# EAGLE schematic Dragon_LowerCase_orig (EAGLE 7.7.0)
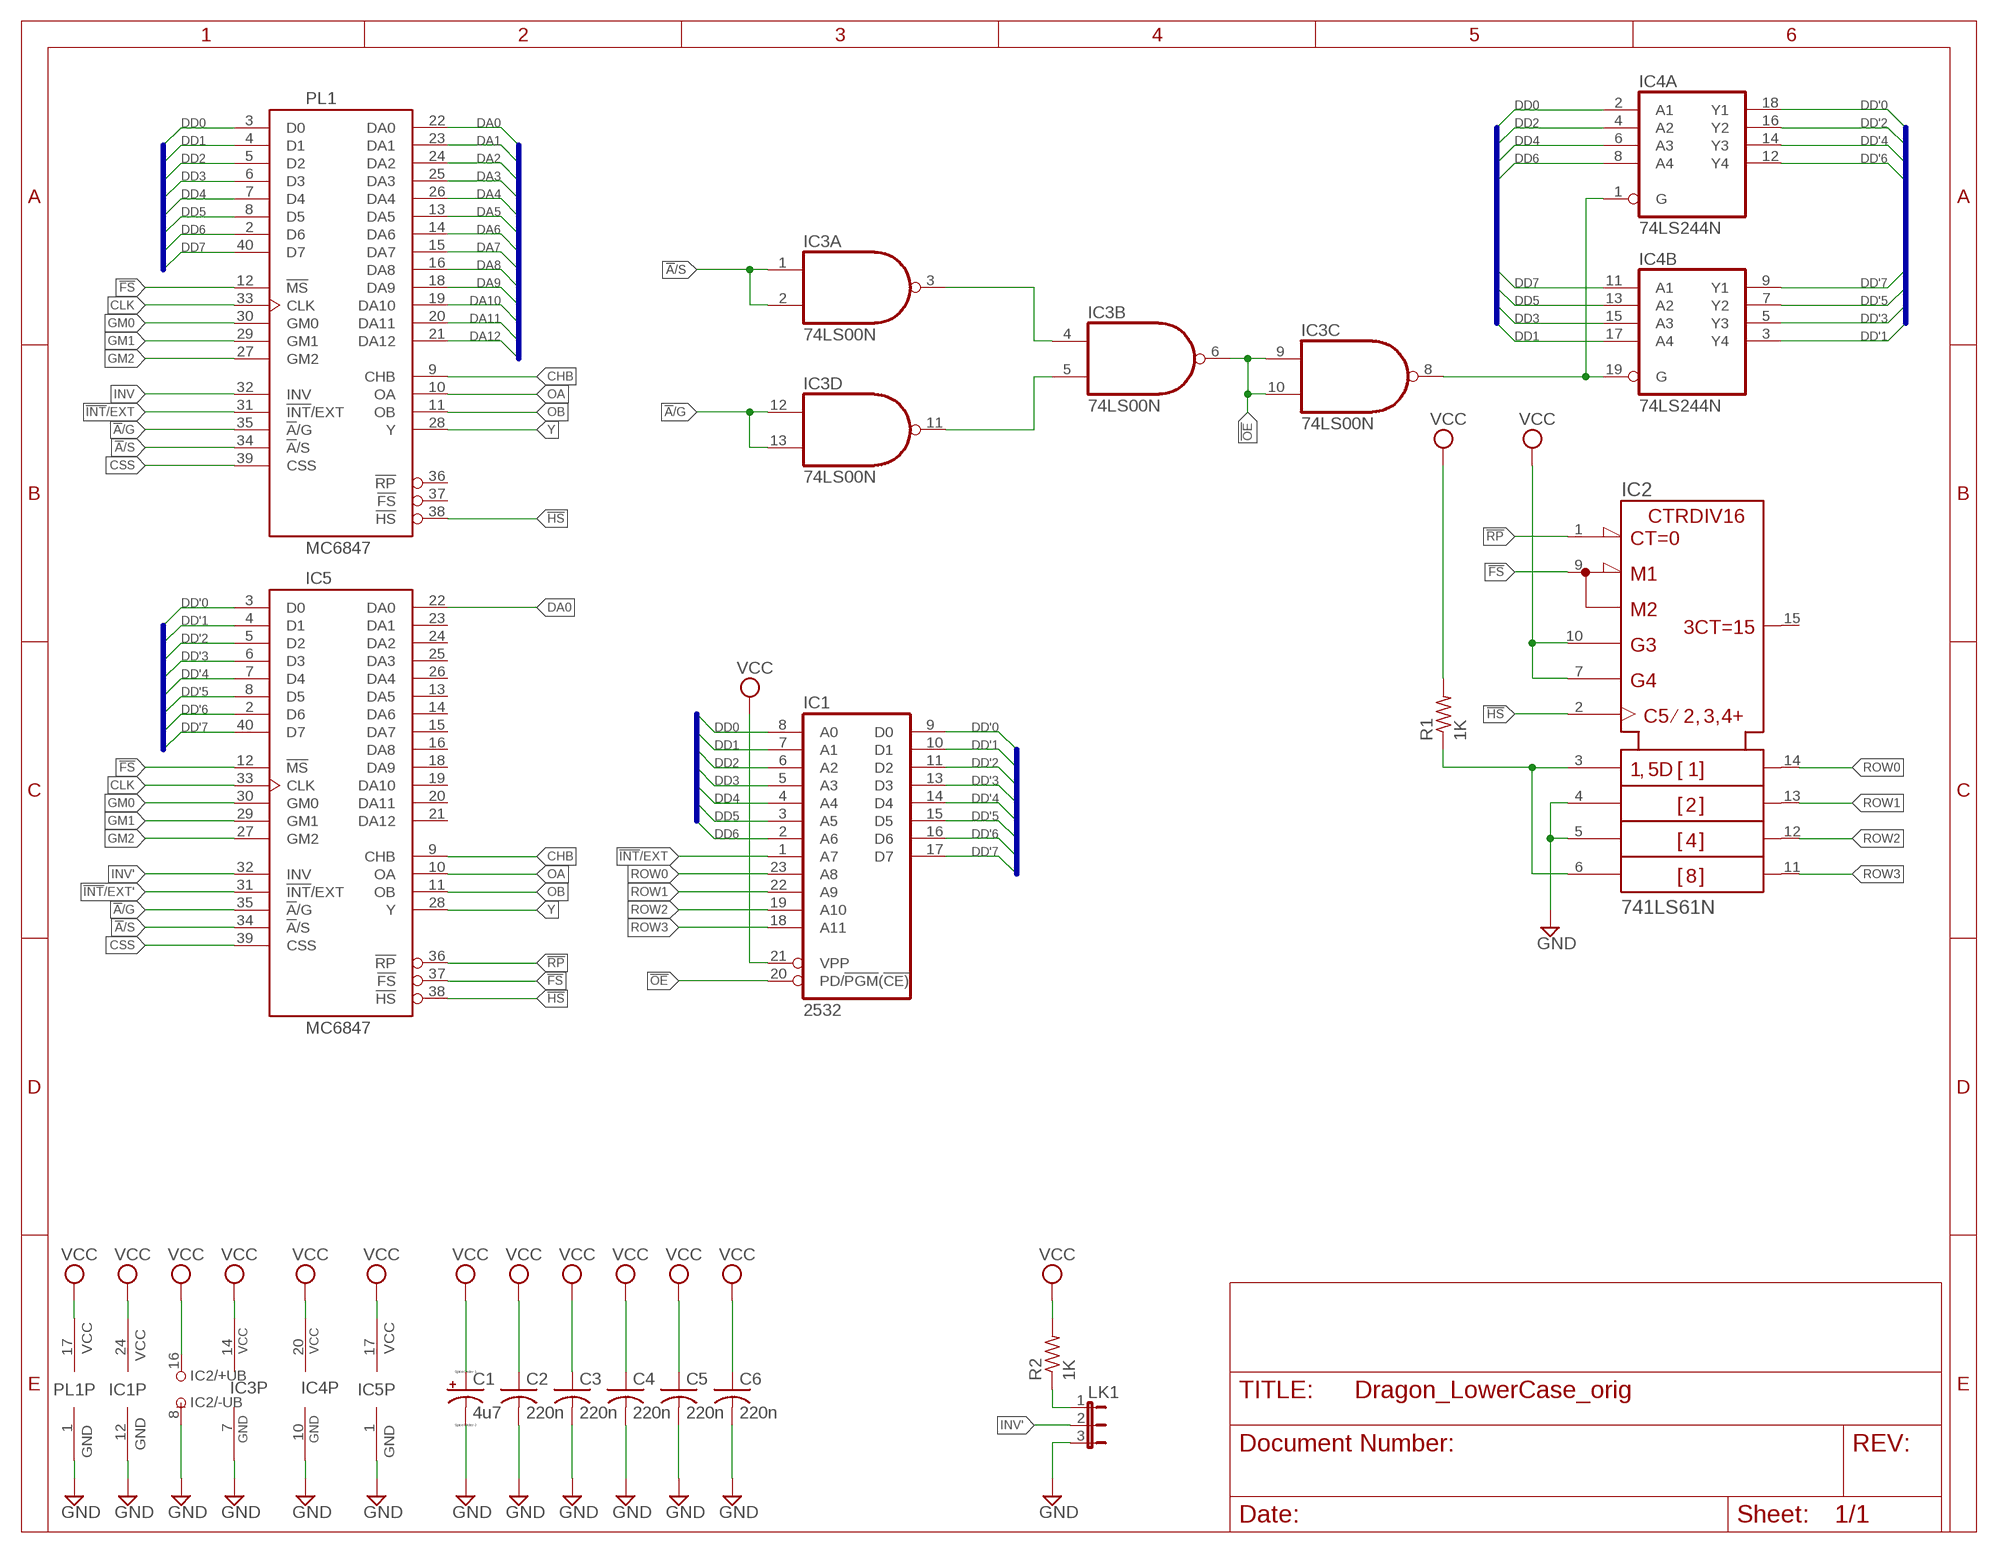
[diagram p0: schematic, sheet 1]

## Parts
C1  4u7  CPOL-USE2.5-5  [E2,5-5]
C2  220n  C-US025-025X050  [C025-025X050]
C3  220n  C-US025-025X050  [C025-025X050]
C4  220n  C-US025-025X050  [C025-025X050]
C5  220n  C-US025-025X050  [C025-025X050]
C6  220n  C-US025-025X050  [C025-025X050]
IC1  2532  [DIL24-6-RP]
IC2  741LS61N  74161N  [DIL16]
IC3  74LS00N  [DIL14-RP]
IC4  74LS244N  [DIL20-RP]
IC5  MC6847  [DIL40]
LK1  JP2E  [JP2]
PL1  MC6847  [DIL40]
R1  1K  R-US_0207/10  [0207/10]
R2  1K  R-US_0207/10  [0207/10]

## Nets
!A!/G: IC3.12(D:I0) IC3.13(D:I1) IC5.35(!A!/G) PL1.35(!A!/G)
!A!/S: IC3.1(A:I0) IC3.2(A:I1) IC5.34(!A!/S) PL1.34(!A!/S)
!FS: IC2.9(!LOAD) IC5.12(!MS) IC5.37(!FS) PL1.12(!MS)
!HS: IC2.2(CLK) IC5.38(!HS) PL1.38(!HS)
!INT!/EXT: IC1.1(A7) PL1.31(!INT!/EXT)
!INT!/EXT': IC3.3(A:O) IC3.4(B:I0) IC5.31(!INT!/EXT)
!OE: IC1.20(PD/!PGM!(!CE)) IC3.6(B:O) IC3.9(C:I0) IC3.10(C:I1)
!RP: IC2.1(!CLR) IC5.36(!RP)
CHB: IC5.9(CHB) PL1.9(CHB)
CLK: IC5.33(CLK) PL1.33(CLK)
CSS: IC5.39(CSS) PL1.39(CSS)
DA0: IC5.22(DA0) PL1.22(DA0)
DA1: PL1.23(DA1)
DA2: PL1.24(DA2)
DA3: PL1.25(DA3)
DA4: PL1.26(DA4)
DA5: PL1.13(DA5)
DA6: PL1.14(DA6)
DA7: PL1.15(DA7)
DA8: PL1.16(DA8)
DA9: PL1.18(DA9)
DA10: PL1.19(DA10)
DA11: PL1.20(DA11)
DA12: PL1.21(DA12)
DD0: IC1.8(A0) IC4.2(A:A1) PL1.3(D0)
DD1: IC1.7(A1) IC4.17(B:A4) PL1.4(D1)
DD2: IC1.6(A2) IC4.4(A:A2) PL1.5(D2)
DD3: IC1.5(A3) IC4.15(B:A3) PL1.6(D3)
DD4: IC1.4(A4) IC4.6(A:A3) PL1.7(D4)
DD5: IC1.3(A5) IC4.13(B:A2) PL1.8(D5)
DD6: IC1.2(A6) IC4.8(A:A4) PL1.2(D6)
DD7: IC4.11(B:A1) PL1.40(D7)
DD'0: IC1.9(D0) IC4.18(A:Y1) IC5.3(D0)
DD'1: IC1.10(D1) IC4.3(B:Y4) IC5.4(D1)
DD'2: IC1.11(D2) IC4.16(A:Y2) IC5.5(D2)
DD'3: IC1.13(D3) IC4.5(B:Y3) IC5.6(D3)
DD'4: IC1.14(D4) IC4.14(A:Y3) IC5.7(D4)
DD'5: IC1.15(D5) IC4.7(B:Y2) IC5.8(D5)
DD'6: IC1.16(D6) IC4.12(A:Y4) IC5.2(D6)
DD'7: IC1.17(D7) IC4.9(B:Y1) IC5.40(D7)
GM0: IC5.30(GM0) PL1.30(GM0)
GM1: IC5.29(GM1) PL1.29(GM1)
GM2: IC5.27(GM2) PL1.27(GM2)
GND: C1.- C2.2 C3.2 C4.2 C5.2 C6.2 IC1.12(GND) IC2.4(B) IC2.5(C) IC2.8(-UB) IC3.7(P:GND) IC4.10(P:GND) IC5.1(GND) LK1.3 PL1.1(GND)
INV: PL1.32(INV)
INV': IC5.32(INV) LK1.2
N$1: IC2.3(A) IC2.6(D) R1.1
N$2: IC3.8(C:O) IC4.1(A:G) IC4.19(B:G)
N$3: LK1.1 R2.1
N$14: IC3.5(B:I1) IC3.11(D:O)
OA: IC5.10(OA) PL1.10(OA)
OB: IC5.11(OB) PL1.11(OB)
ROW0: IC1.23(A8) IC2.14(QA)
ROW1: IC1.22(A9) IC2.13(QB)
ROW2: IC1.19(A10) IC2.12(QC)
ROW3: IC1.18(A11) IC2.11(QD)
VCC: C1.+ C2.1 C3.1 C4.1 C5.1 C6.1 IC1.21(VPP) IC1.24(VCC) IC2.7(ENP) IC2.10(ENT) IC2.16(+UB) IC3.14(P:VCC) IC4.20(P:VCC) IC5.17(VCC) PL1.17(VCC) R1.2 R2.2
Y: IC5.28(Y) PL1.28(Y)
Unconnected: IC2.15(RCO) IC5.13(DA5) IC5.14(DA6) IC5.15(DA7) IC5.16(DA8) IC5.18(DA9) IC5.19(DA10) IC5.20(DA11) IC5.21(DA12) IC5.23(DA1) IC5.24(DA2) IC5.25(DA3) IC5.26(DA4) PL1.36(!RP) PL1.37(!FS)

## Buses
DA[0..12]
DD[0..7]
DD'[0..7]

## Library data of the parts
C1 = resistor:CPOL-US: POLARIZED CAPACITOR, American symbol
C2-C6 = resistor:C-US: CAPACITOR, American symbol
IC1 = memory-jlb:2532
IC2 = 74ttl-din-rp:74*161: Synchrounus 4-bit COUNTER
IC3 = 74xx-us-jlb:74*00: Quad 2-input NAND gate
IC4 = 74xx-us-jlb:74*244: Octal BUFFER and LINE DRIVER, 3-state
IC5 PL1 = micro-motorola-rp:MC6847
LK1 = jumper-jlb:JP2E: JUMPER
R1 R2 = resistor:R-US_: RESISTOR, American symbol